# Altium schematic sheet Ring 4_A.SchDoc
size A; SheetNumber: 18; SheetTotal: 30
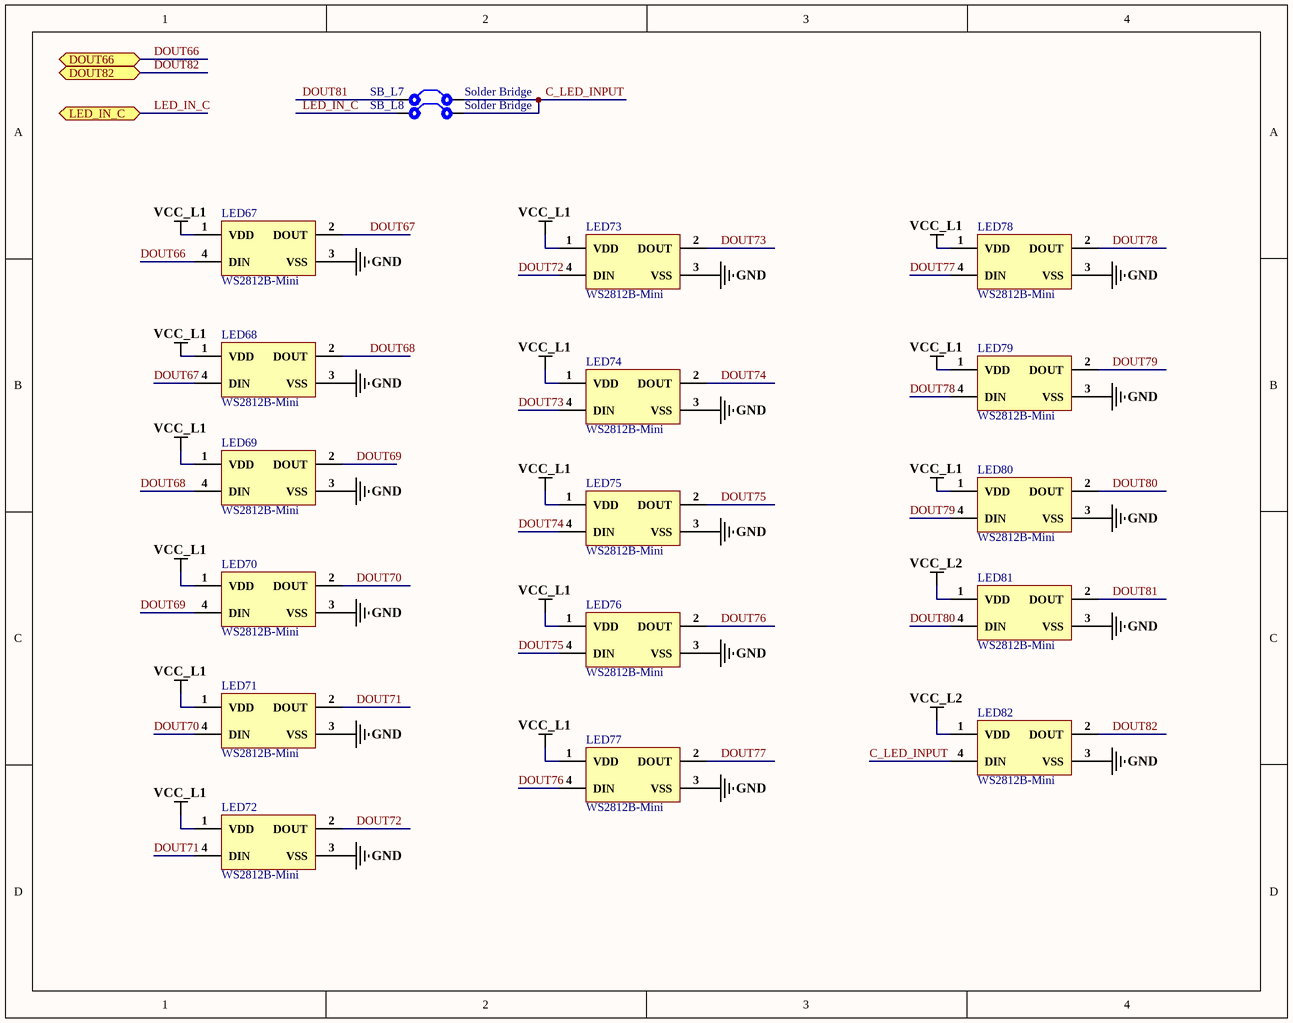
[diagram p0: Ring 4_A.SchDoc]

## Parts
LED67  WS2812B-Mini  [WS2812B-Mini]
LED68  WS2812B-Mini  [WS2812B-Mini]
LED69  WS2812B-Mini  [WS2812B-Mini]
LED70  WS2812B-Mini  [WS2812B-Mini]
LED71  WS2812B-Mini  [WS2812B-Mini]
LED72  WS2812B-Mini  [WS2812B-Mini]
LED73  WS2812B-Mini  [WS2812B-Mini]
LED74  WS2812B-Mini  [WS2812B-Mini]
LED75  WS2812B-Mini  [WS2812B-Mini]
LED76  WS2812B-Mini  [WS2812B-Mini]
LED77  WS2812B-Mini  [WS2812B-Mini]
LED78  WS2812B-Mini  [WS2812B-Mini]
LED79  WS2812B-Mini  [WS2812B-Mini]
LED80  WS2812B-Mini  [WS2812B-Mini]
LED81  WS2812B-Mini  [WS2812B-Mini]
LED82  WS2812B-Mini  [WS2812B-Mini]
SB_L7  Solder Bridge  [Solder Bridge]
SB_L8  Solder Bridge  [Solder Bridge]

## Ports
DOUT66 (bidir), DOUT82 (bidir), LED_IN_C (bidir)

## Nets
GND: LED67.3(VSS) LED68.3(VSS) LED69.3(VSS) LED70.3(VSS) LED71.3(VSS) LED72.3(VSS) LED73.3(VSS) LED74.3(VSS) LED75.3(VSS) LED76.3(VSS) LED77.3(VSS) LED78.3(VSS) LED79.3(VSS) LED80.3(VSS) LED81.3(VSS) LED82.3(VSS)
VCC_L1: LED67.1(VDD) LED68.1(VDD) LED69.1(VDD) LED70.1(VDD) LED71.1(VDD) LED72.1(VDD) LED73.1(VDD) LED74.1(VDD) LED75.1(VDD) LED76.1(VDD) LED77.1(VDD) LED78.1(VDD) LED79.1(VDD) LED80.1(VDD)
VCC_L2: LED81.1(VDD) LED82.1(VDD)
C_LED_INPUT: LED82.4(DIN) SB_L7.2 SB_L8.2
DOUT66: LED67.4(DIN) ; port DOUT66
DOUT67: LED67.2(DOUT) LED68.4(DIN)
DOUT68: LED68.2(DOUT) LED69.4(DIN)
DOUT69: LED69.2(DOUT) LED70.4(DIN)
DOUT70: LED70.2(DOUT) LED71.4(DIN)
DOUT71: LED71.2(DOUT) LED72.4(DIN)
DOUT72: LED72.2(DOUT) LED73.4(DIN)
DOUT73: LED73.2(DOUT) LED74.4(DIN)
DOUT74: LED74.2(DOUT) LED75.4(DIN)
DOUT75: LED75.2(DOUT) LED76.4(DIN)
DOUT76: LED76.2(DOUT) LED77.4(DIN)
DOUT77: LED77.2(DOUT) LED78.4(DIN)
DOUT78: LED78.2(DOUT) LED79.4(DIN)
DOUT79: LED79.2(DOUT) LED80.4(DIN)
DOUT80: LED80.2(DOUT) LED81.4(DIN)
DOUT81: LED81.2(DOUT) SB_L7.1
DOUT82: LED82.2(DOUT) ; port DOUT82
LED_IN_C: SB_L8.1 ; port LED_IN_C

## Library data of the parts
LED67-LED82 = WS2812B-Mini: SMD,3.5x3.5mm Light Emitting Diodes (LED) RoHS; Manufacturer: Worldsemi; ComponentLink1Description: LCSC; ComponentLink1URL: *https://lcsc.com/product-detail/Light-Emitting-Diodes-LED_Worldsemi-WS2812B-Mini_C527089.html; Package: SMD,3.5x3.5mm; Parameter 1: *
SB_L7 SB_L8 = Solder Bridge: Solder Bridge ON